# EAGLE design Spar7_rebuild (EAGLE 9.6.2)

## Sheet 1 of 3: Power rails
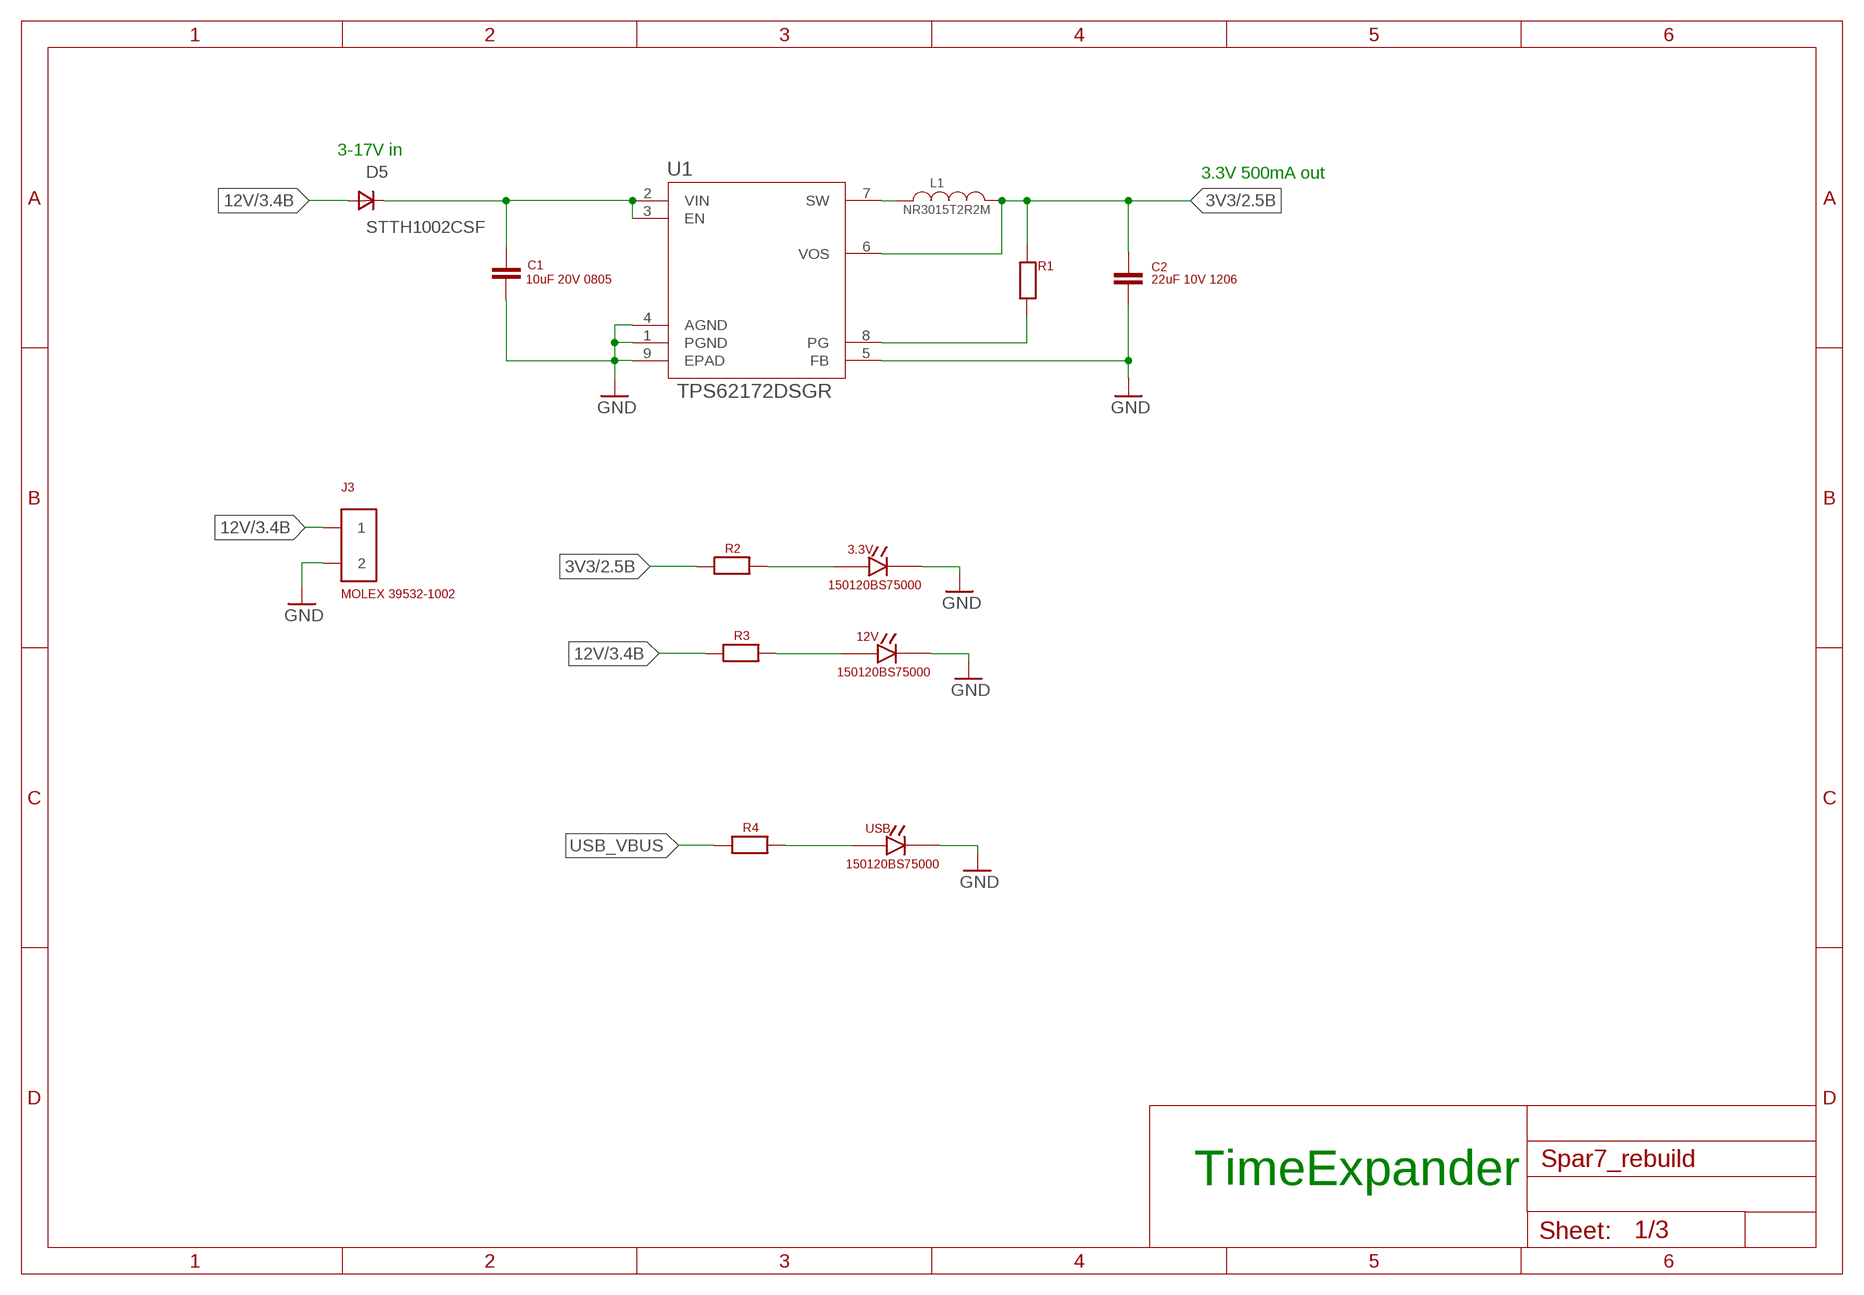
[diagram p0: schematic, sheet 1]

### Parts
3.3V  150120BS75000  LED150120BS75000  [150120BS75000]
12V  150120BS75000  LED150120BS75000  [150120BS75000]
C1  10uF 20V 0805  CAPACITOR0805  [CAP_0805]
C2  22uF 10V 1206  CAPACITOR1206  [CAP_1206]
D5  STTH1002CSF  DIODESTTH1002CSF  [DIODE_STTH1002CSF]
J3  MOLEX-39532-1002  [MOLEX-39532-1002]
L1  NR3015T2R2M  [IND_TAIYO_NR3015_TAY]
R1  RESISTOR0402  [RES_0402]
R2  RESISTOR0402  [RES_0402]
R3  RESISTOR0402  [RES_0402]
R4  RESISTOR0402  [RES_0402]
U1  TPS62172DSGR  TPS62173DSGR  [DSG8_1P6X0P9]
USB  150120BS75000  LED150120BS75000  [150120BS75000]

### Nets
3V3: C2.P$1 L1.1 R1.P$1 R2.P$1 U1.6(VOS) ; also sheet 2
12V: D5.A1(A) D5.A2(A) J3.1 R3.P$1 ; also sheet 3
GND: 3.3V.C 12V.C C1.P$2 C2.P$2 J3.2 U1.1(PGND) U1.4(AGND) U1.5(FB) U1.9(EPAD) USB.C ; also sheet 2,3
N$1: L1.2 U1.7(SW)
N$2: 12V.A R3.P$2
N$3: R1.P$2 U1.8(PG)
N$5: R4.P$2 USB.A
N$6: 3.3V.A R2.P$2
N$30: C1.P$1 D5.C U1.2(VIN) U1.3(EN)
USB_VBUS: R4.P$1 ; also sheet 2

### Notes on the sheet
- 3-17V in
- 3.3V 500mA out
- TimeExpander

## Sheet 2 of 3: MCU + USB
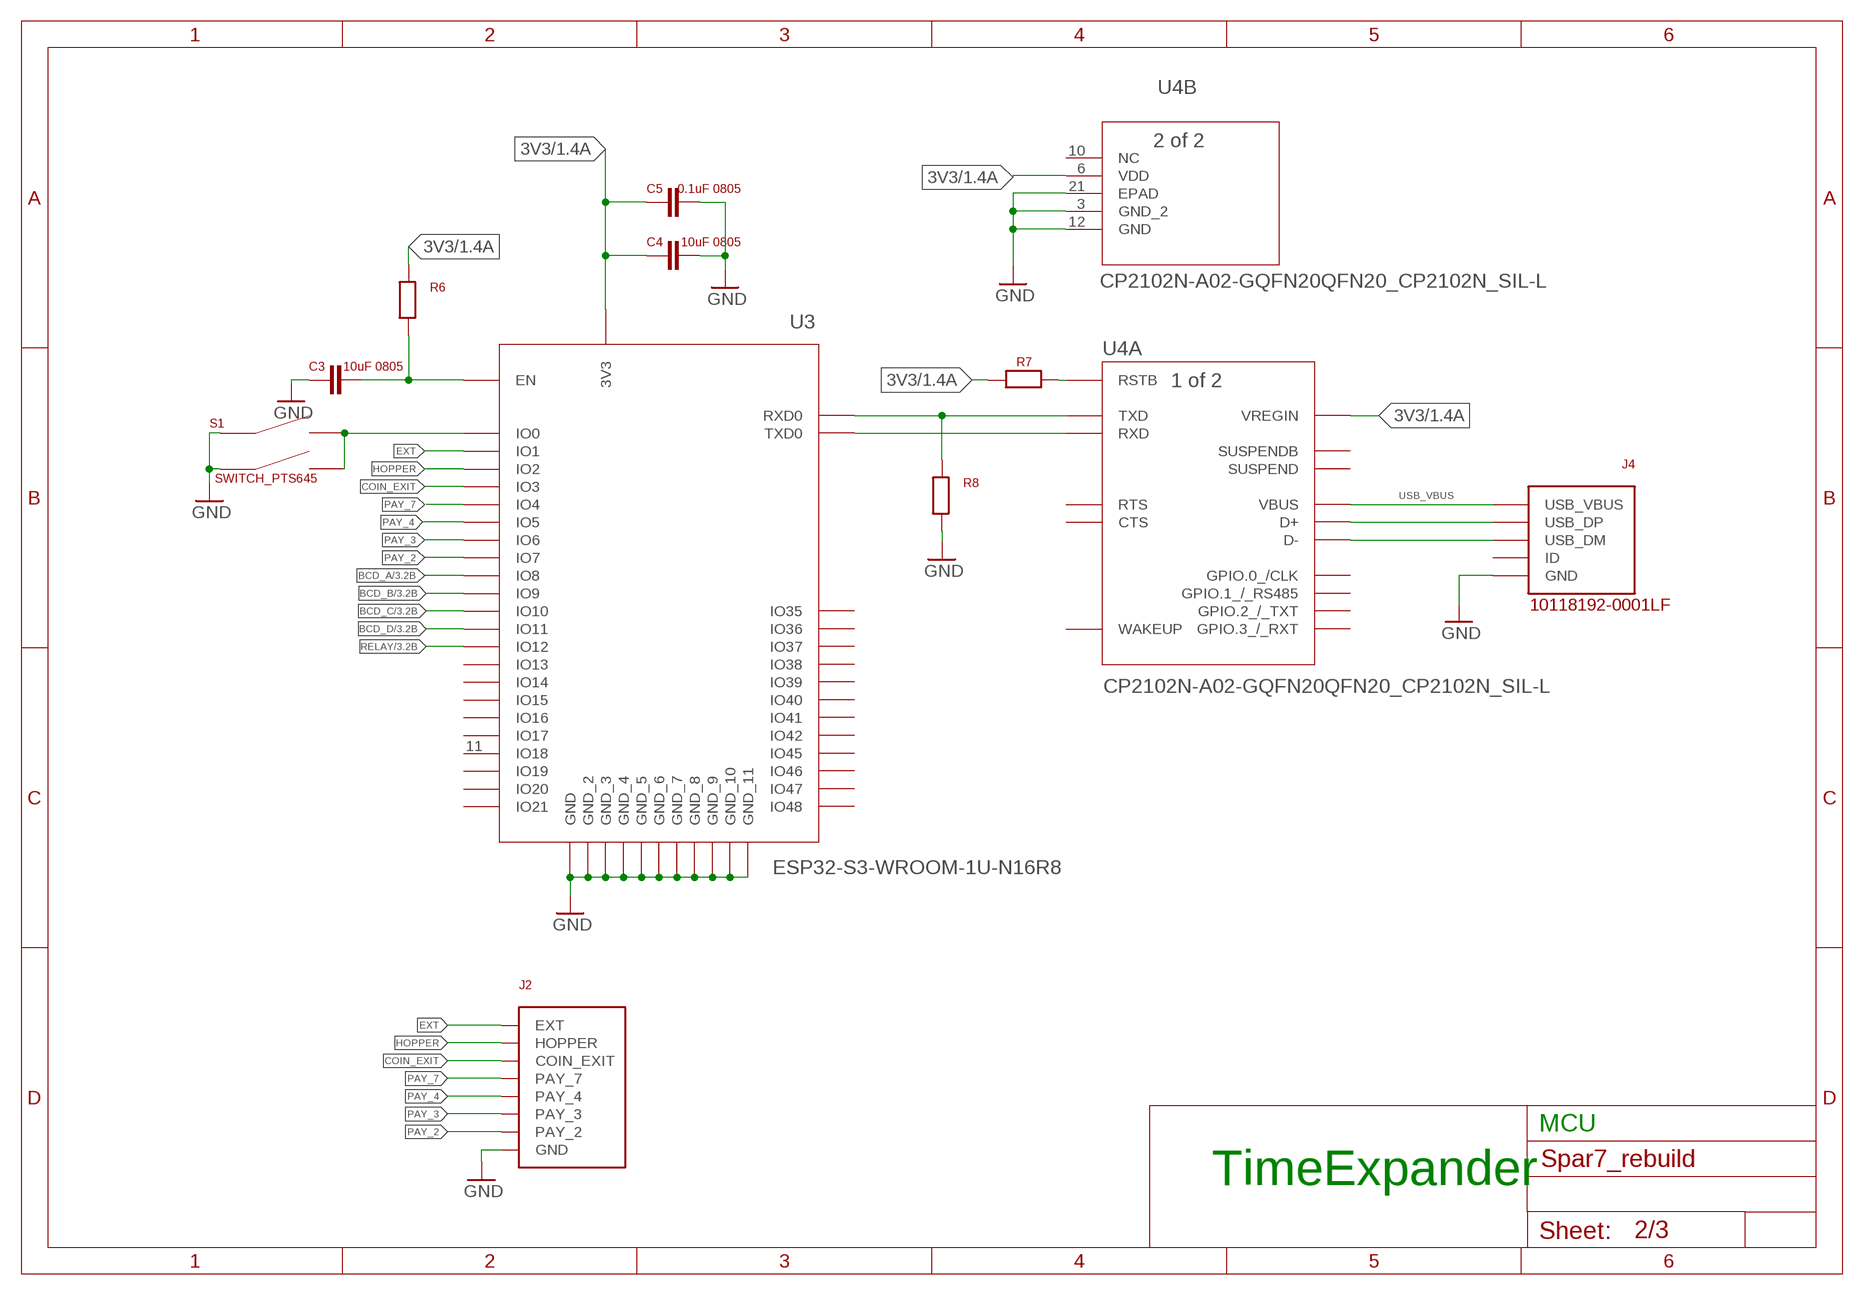
[diagram p1: schematic, sheet 2]

### Parts
C3  10uF 0805  CAPACITOR0805  [CAP_0805]
C4  10uF 0805  CAPACITOR0805  [CAP_0805]
C5  0.1uF 0805  CAPACITOR0805  [CAP_0805]
J2  SPAR7_REWIRED_TERM_BLOCK  [SPAR7_REWIRED_TERM_BLOCK]
J4  10118192-0001LF  USB_RCPT_10118192-0001LF  [USB_RCPT_10118192-0001LF]
R6  RESISTOR0402  [RES_0402]
R7  RESISTOR0402  [RES_0402]
R8  RESISTOR0402  [RES_0402]
S1  SWITCH_PTS645  [SWITCH_PTS645_EE_NBIOT_01]
U3  ESP32-S3-WROOM-1U-N16R8  [ESP32­S3­WROOM­1U_EXP]
U4  CP2102N-A02-GQFN20QFN20_CP2102N_SIL-L  [QFN20_CP2102N_SIL-L]

### Nets
3V3: C4.P$1 C5.P$1 R6.P$2 R7.P$1 U3.2(3V3) U4.6(B:VDD) U4.7(A:VREGIN) ; also sheet 1
BCD_A: U3.12(IO8) ; also sheet 3
BCD_B: U3.17(IO9) ; also sheet 3
BCD_C: U3.18(IO10) ; also sheet 3
BCD_D: U3.19(IO11) ; also sheet 3
COIN_EXIT: J2.COIN_EXIT U3.15(IO3)
EXT: J2.EXT U3.39(IO1)
GND: C3.P$1 C4.P$2 C5.P$2 J2.GND J4.GND R8.P$1 S1.A1 S1.A2 U3.1(GND_2) U3.40(GND_3) U3.41(GND_4) U3.42(GND_5) U3.43(GND_6) U3.44(GND_7) U3.45(GND_8) U3.46(GND_9) U3.47(GND_10) U3.48(GND_11) U3.49(GND) U4.3(B:GND_2) U4.12(B:GND) U4.21(B:EPAD) ; also sheet 1,3
HOPPER: J2.HOPPER U3.38(IO2)
N$31: J4.D+(USB_DP) U4.4(A:D+)
N$32: J4.D-(USB_DM) U4.5(A:D-)
N$33: R7.P$2 U4.9(A:RSTB)
N$34: R8.P$2 U3.36(RXD0) U4.18(A:TXD)
N$35: U3.37(TXD0) U4.17(A:RXD)
N$36: S1.B1 S1.B2 U3.27(IO0)
N$37: C3.P$2 R6.P$1 U3.3(EN)
PAY_2: J2.PAY_2 U3.7(IO7)
PAY_3: J2.PAY_3 U3.6(IO6)
PAY_4: J2.PAY_4 U3.5(IO5)
PAY_7: J2.PAY_7 U3.4(IO4)
RELAY: U3.20(IO12) ; also sheet 3
USB_VBUS: J4.VCC(USB_VBUS) U4.8(A:VBUS) ; also sheet 1
Unconnected: J4.ID U3.8(IO15) U3.9(IO16) U3.10(IO17) U3.11(IO18) U3.13(IO19) U3.14(IO20) U3.16(IO46) U3.21(IO13) U3.22(IO14) U3.23(IO21) U3.24(IO47) U3.25(IO48) U3.26(IO45) U3.28(IO35) U3.29(IO36) U3.30(IO37) U3.31(IO38) U3.32(IO39) U3.33(IO40) U3.34(IO41) U3.35(IO42) U4.1(A:GPIO.1_/_RS485) U4.2(A:GPIO.0_/CLK) U4.10(B:NC) U4.11(A:SUSPENDB) U4.13(A:WAKEUP) U4.14(A:SUSPEND) U4.15(A:CTS) U4.16(A:RTS) U4.19(A:GPIO.3_/_RXT) U4.20(A:GPIO.2_/_TXT)

### Notes on the sheet
- MCU
- TimeExpander

## Sheet 3 of 3: LED + RELAY
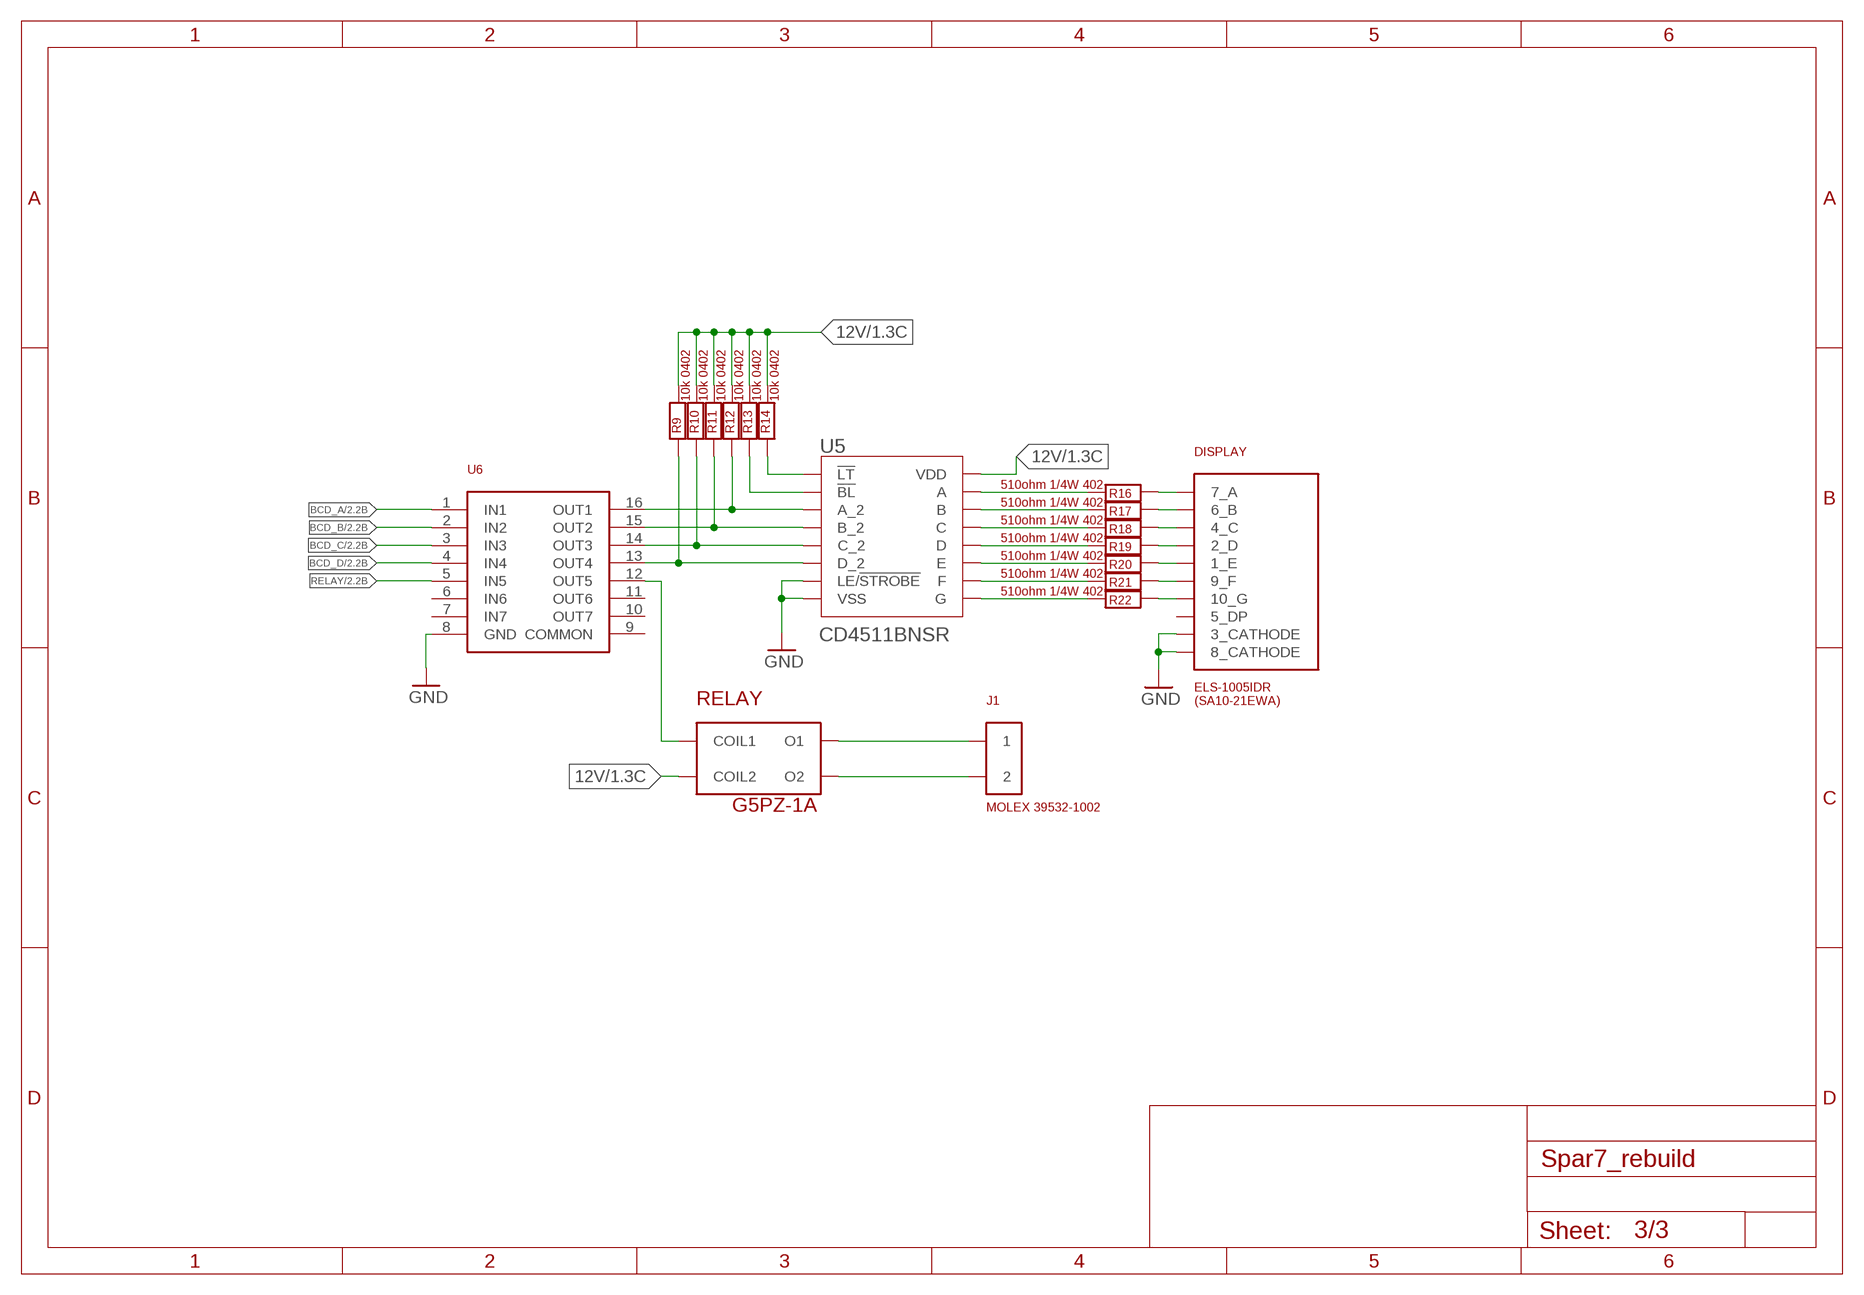
[diagram p2: schematic, sheet 3]

### Parts
DISPLAY  ELS-1005IDR-SA10-21EWA  [ELS-1005IDR-SA10-21EWA]
J1  MOLEX-39532-1002  [MOLEX-39532-1002]
R9  10k 0402  RESISTOR0402  [RES_0402]
R10  10k 0402  RESISTOR0402  [RES_0402]
R11  10k 0402  RESISTOR0402  [RES_0402]
R12  10k 0402  RESISTOR0402  [RES_0402]
R13  10k 0402  RESISTOR0402  [RES_0402]
R14  10k 0402  RESISTOR0402  [RES_0402]
R16  510ohm 1/4W 402  RESISTOR0402  [RES_0402]
R17  510ohm 1/4W 402  RESISTOR0402  [RES_0402]
R18  510ohm 1/4W 402  RESISTOR0402  [RES_0402]
R19  510ohm 1/4W 402  RESISTOR0402  [RES_0402]
R20  510ohm 1/4W 402  RESISTOR0402  [RES_0402]
R21  510ohm 1/4W 402  RESISTOR0402  [RES_0402]
R22  510ohm 1/4W 402  RESISTOR0402  [RES_0402]
RELAY  G5PZ-1A_RELAY  [G5PZ-1A_RELAY]
U5  CD4511BNSR  [NS16]
U6  ULN2003D1013TR  [SO16-NARROW]

### Nets
12V: R9.P$2 R10.P$2 R11.P$2 R12.P$2 R13.P$2 R14.P$2 RELAY.COIL2 U5.16(VDD) ; also sheet 1
BCD_A: U6.1(IN1) ; also sheet 2
BCD_B: U6.2(IN2) ; also sheet 2
BCD_C: U6.3(IN3) ; also sheet 2
BCD_D: U6.4(IN4) ; also sheet 2
GND: DISPLAY.3_CATHODE DISPLAY.8_CATHODE U5.5(LE/!STROBE) U5.8(VSS) U6.8(GND) ; also sheet 1,2
N$4: J1.1 RELAY.O1
N$7: DISPLAY.7_A R16.P$1
N$8: DISPLAY.6_B R17.P$1
N$9: DISPLAY.4_C R18.P$1
N$10: DISPLAY.2_D R19.P$1
N$11: DISPLAY.1_E R20.P$1
N$12: DISPLAY.9_F R21.P$1
N$13: DISPLAY.10_G R22.P$1
N$14: R16.P$2 U5.13(A)
N$15: R17.P$2 U5.12(B)
N$16: R18.P$2 U5.11(C)
N$17: R19.P$2 U5.10(D)
N$18: R20.P$2 U5.9(E)
N$19: R21.P$2 U5.15(F)
N$20: R22.P$2 U5.14(G)
N$21: R14.P$1 U5.3(!LT)
N$22: R13.P$1 U5.4(!BL)
N$23: R12.P$1 U5.7(A_2) U6.16(OUT1)
N$24: R11.P$1 U5.1(B_2) U6.15(OUT2)
N$25: R10.P$1 U5.2(C_2) U6.14(OUT3)
N$26: R9.P$1 U5.6(D_2) U6.13(OUT4)
N$27: RELAY.COIL1 U6.12(OUT5)
N$28: J1.2 RELAY.O2
RELAY: U6.5(IN5) ; also sheet 2
Unconnected: DISPLAY.5_DP U6.6(IN6) U6.7(IN7) U6.9(COMMON) U6.10(OUT7) U6.11(OUT6)

## Library data of the parts
3.3V 12V USB = TimeExpander2:LED
C1-C5 = TimeExpander2:CAPACITOR
D5 = TimeExpander2:DIODE
DISPLAY = TimeExpander2:ELS-1005IDR-SA10-21EWA
J1 J3 = TimeExpander2:MOLEX-39532-1002
J2 = TimeExpander2:SPAR7_REWIRED_TERM_BLOCK
J4 = TimeExpander2:USB_RCPT_10118192-0001LF
L1 = TimeExpander2:NR3015T2R2M; BUILT_BY: EMA_UL_Team; MANUFACTURER_PART_NUMBER: NR3015T2R2M; SOURCELIBRARY: TaiyoYuden_2011-01-01_IND_NR; VENDOR: TAIYO YUDEN
R1-R4 R6-R14 R16-R22 = TimeExpander2:RESISTOR
RELAY = TimeExpander2:G5PZ-1A_RELAY
S1 = TimeExpander2:SWITCH_PTS645
U1 = TimeExpander2:TPS62173DSGR; DATASHEET_URL: http://www.ti.com/lit/gpn/TPS62173; DESCRIPTION: 317V 0.5A Step-Down Converter in 2x2 QFN package; FAMILY_NAME: STEP-DOWN REGULATOR; GENERIC_PART_NUMBER: TPS62173; INDUSTRY_STD_PKG_TYPE: WSON; MANUFACTURER: Texas Instruments; MANUFACTURER_PART_NUMBER: TPS62173DSGR; PACKAGE_DESIGNATOR: DSG; PIN_COUNT: 8; VENDOR: Texas Instruments
U3 = TimeExpander2:ESP32-S3-WROOM-1U-N16R8; COPYRIGHT: Copyright (C) 2023 Ultra Librarian. All rights reserved.; MANUFACTURER_PART_NUMBER: ESP32-S3-WROOM-1U-N16R8; MFR_NAME: Espressif Systems
U4 = TimeExpander2:CP2102N-A02-GQFN20; COPYRIGHT: Copyright (C) 2023 Ultra Librarian. All rights reserved.; MANUFACTURER_PART_NUMBER: CP2102N-A02-GQFN20; MFR_NAME: Silicon Labs
U5 = TimeExpander2:CD4511BNSR; COPYRIGHT: Copyright (C) 2023 Ultra Librarian. All rights reserved.; MANUFACTURER_PART_NUMBER: CD4511BNSR; MFR_NAME: Texas Instruments
U6 = EE_copy:ULN2003D1013TR

## Board
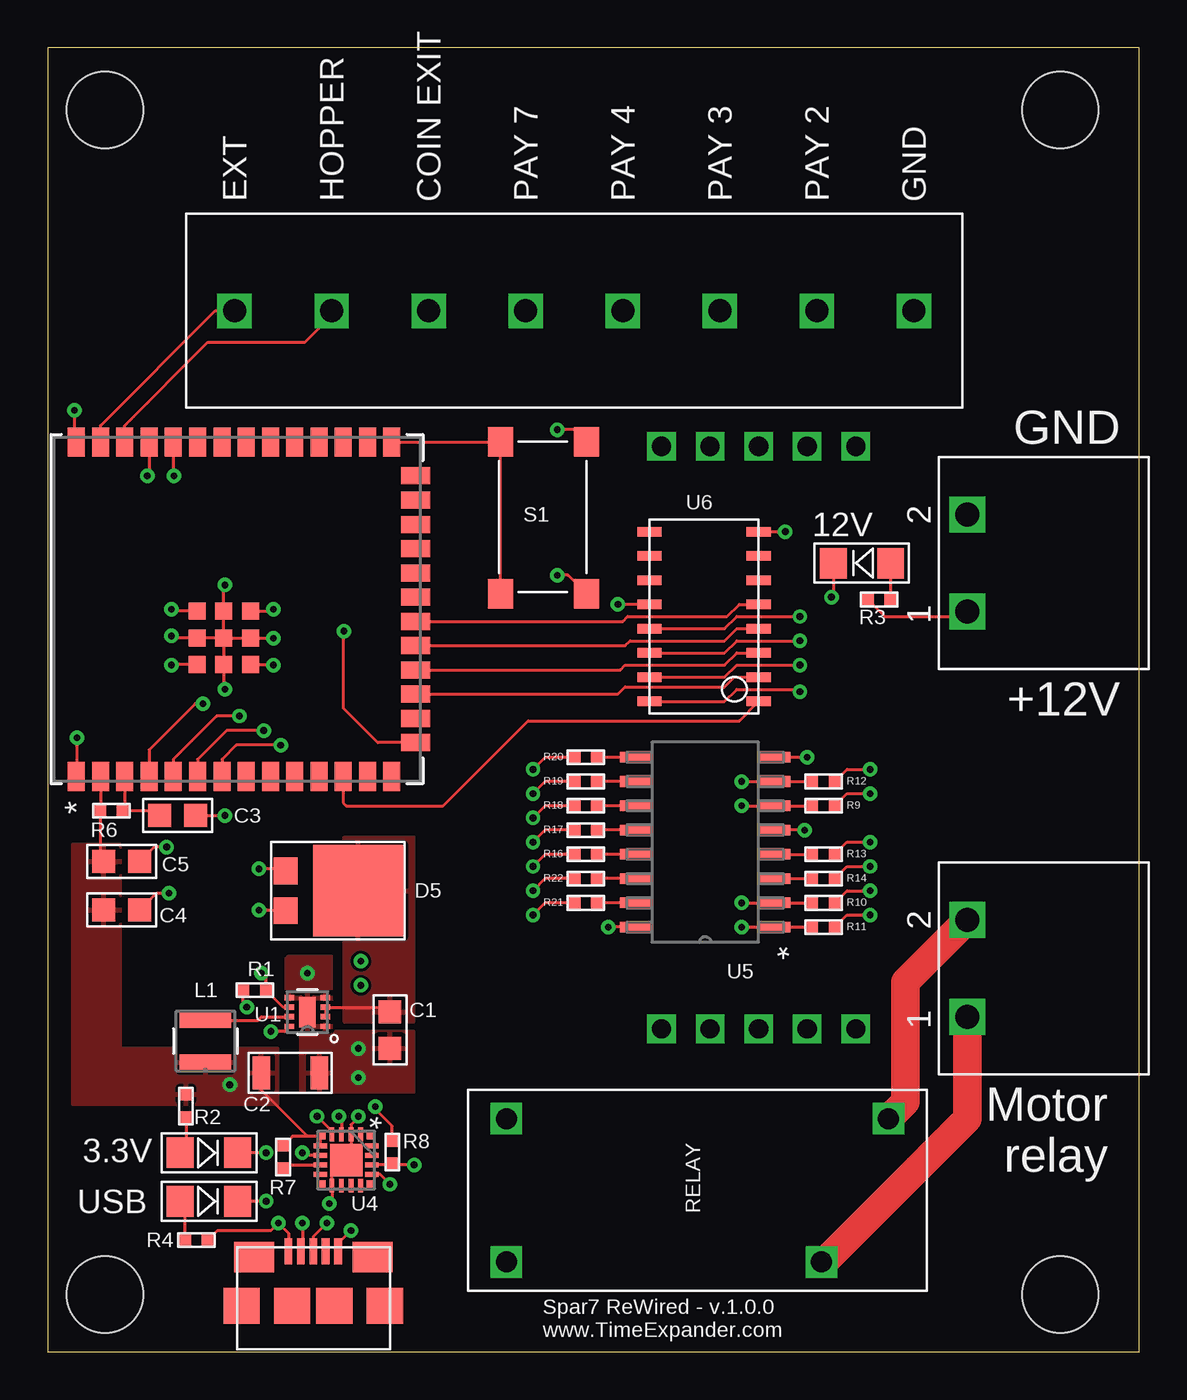
[diagram p3: board, top side]
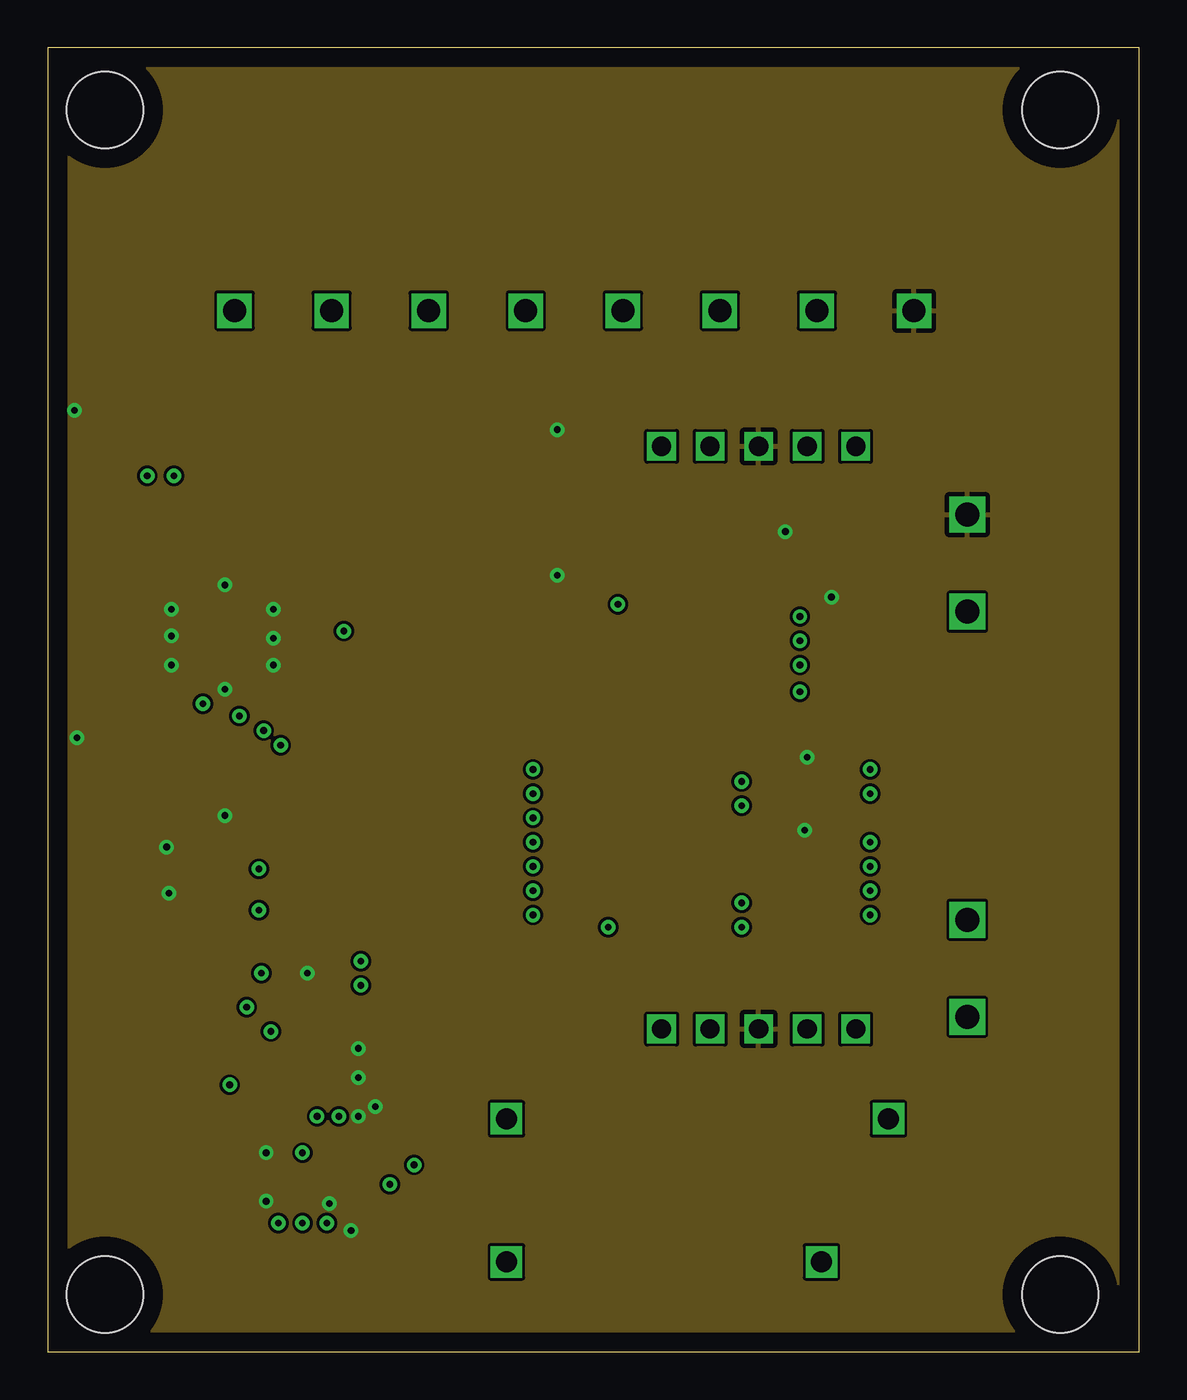
[diagram p4: board, inner layer GND]
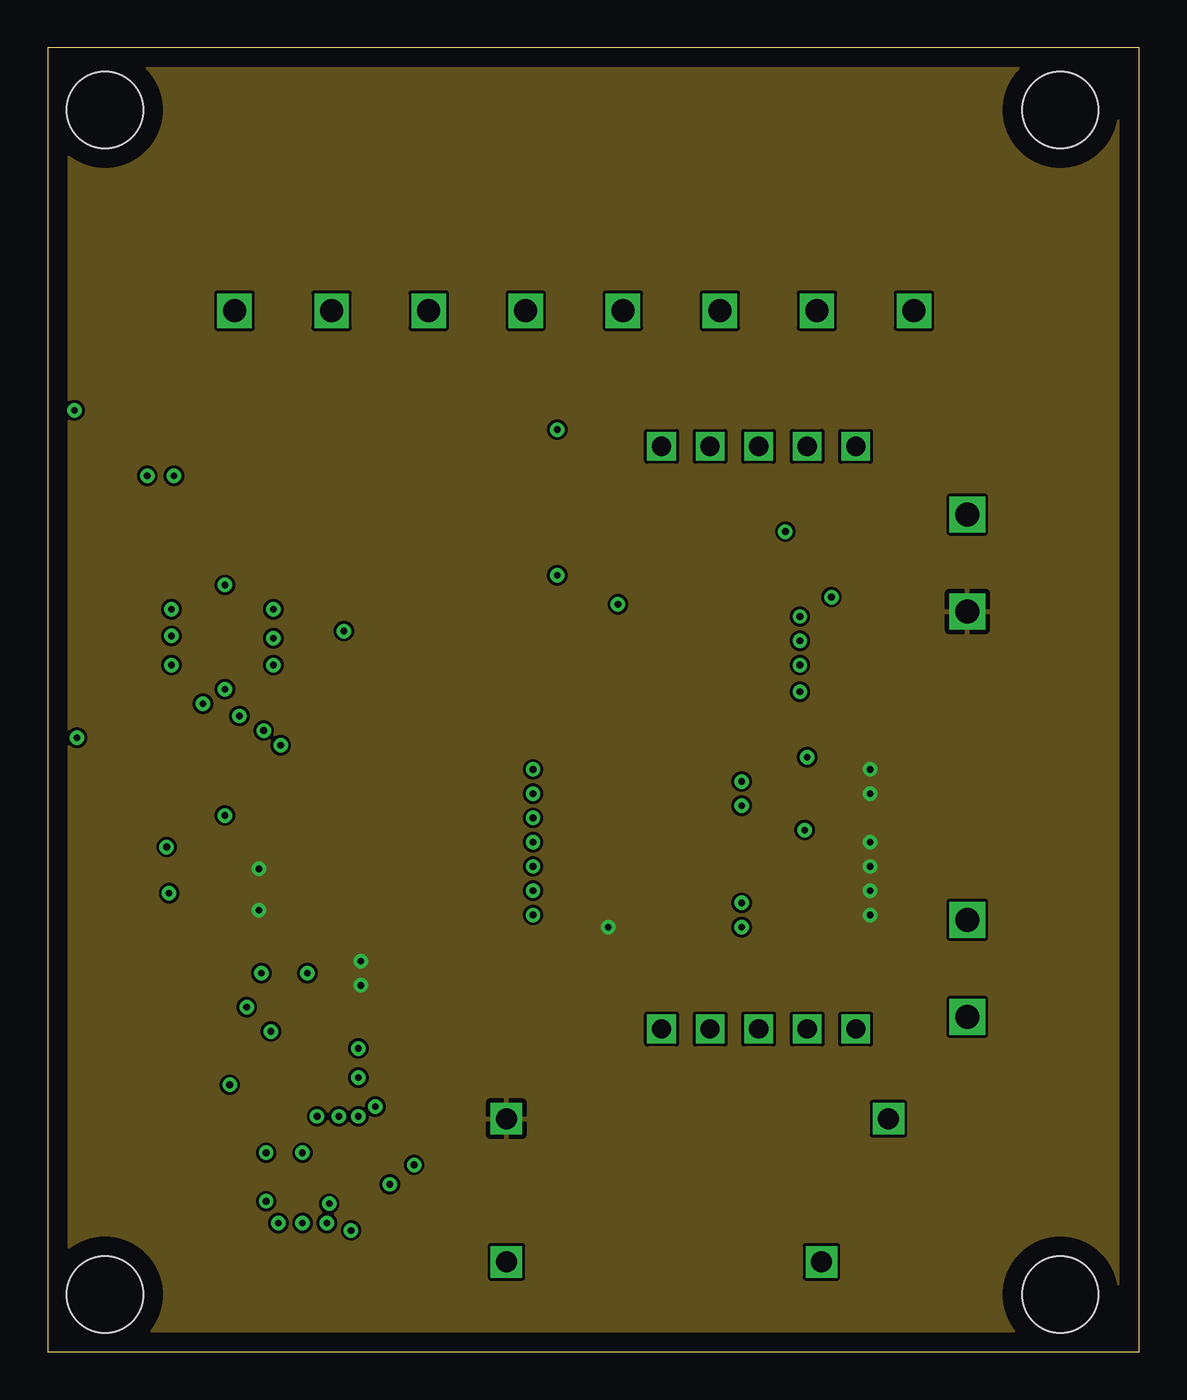
[diagram p5: board, inner layer 12V]
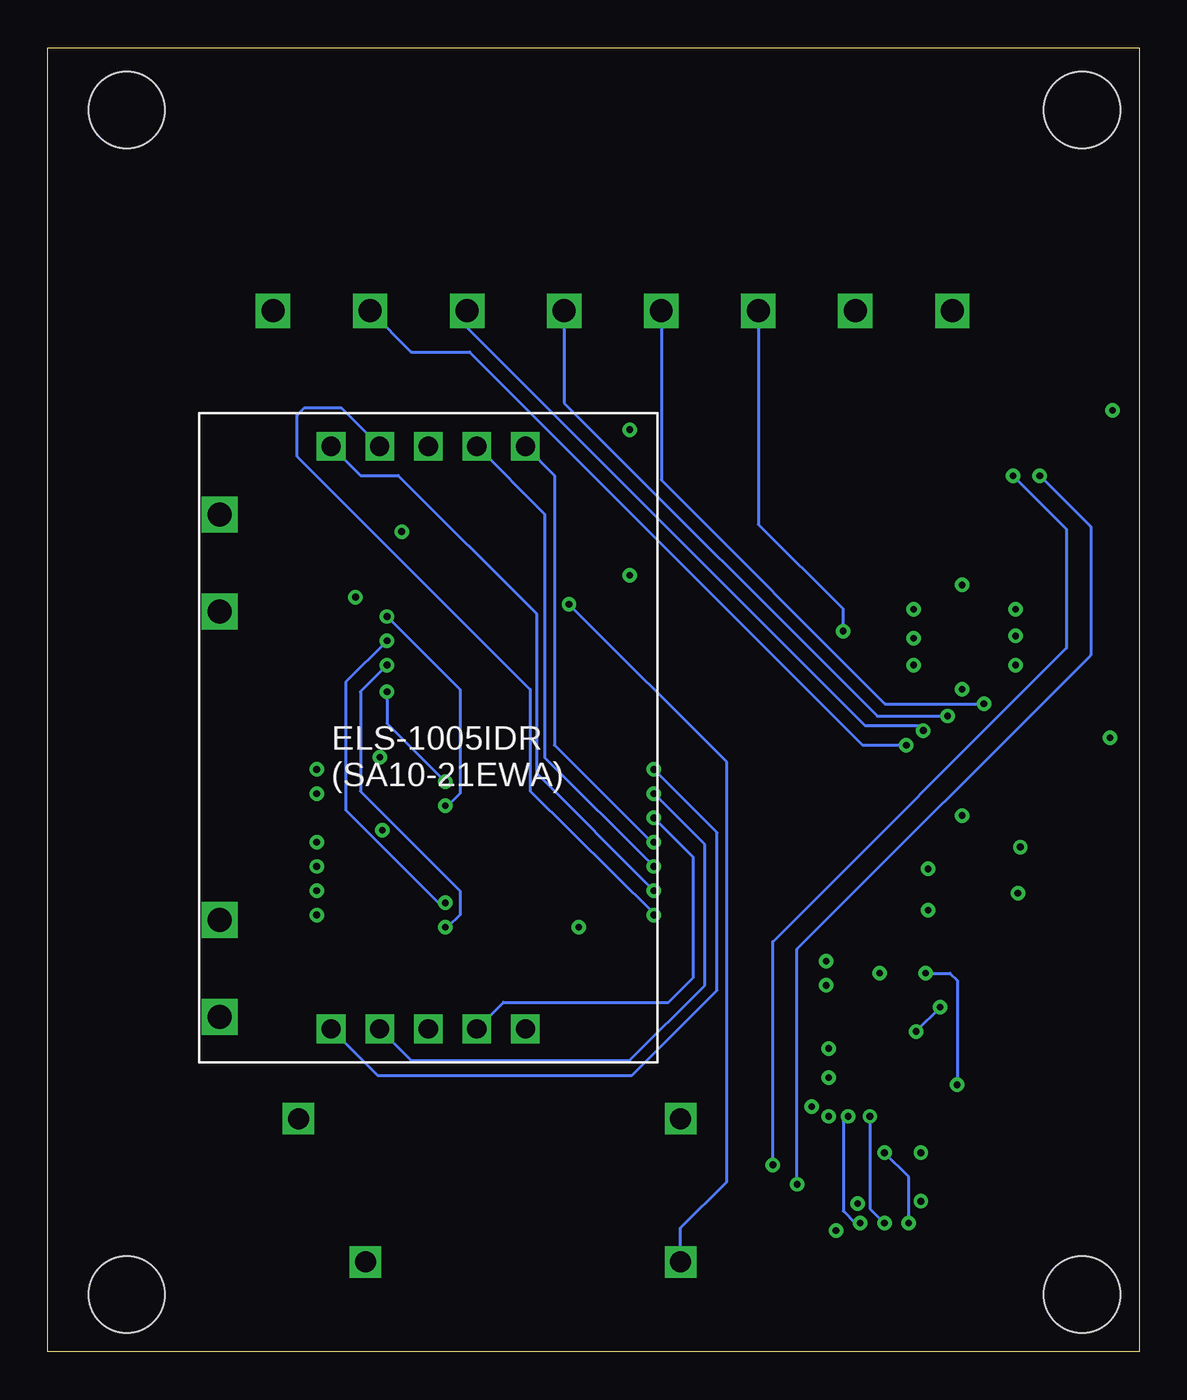
[diagram p6: board, bottom side, seen from below]

Size 57.13 x 68.25 mm. Coordinates in mm from the lower left corner, seen from the top.
Outline: 0,0 57.13,0 57.13,68.25 0,68.25 0,0
Copper layers (1+2*15+16): Top 0.035mm / dielectric 1.5mm / GND 0.035mm / dielectric 0.15mm / 12V 0.035mm / dielectric 0.2mm / Bottom 0.035mm
Design rules "default *": minimum track width 6mil, minimum drill 0.35mm, track to track 6mil, track to pad 6mil, pad to pad 6mil, via to via 6mil, smd to smd 6mil, copper to edge 40mil, drill to drill 6mil, minimum pad ring 10mil, minimum via ring 8mil, stop-mask expansion 6mil, vias tented up to drill 14mil, thermal gap 10mil
Holes 4 mm at 3,65 53,65 3,3 53,3

### Footprints (pad centres in the part's own frame; a part is rotated, then mirrored left to right if it is on the bottom)
150120BS75000 = smd 1.4 x 1.6: A -3,0; C -6,0
CAP_0805 = smd 1.2 x 1.2: P$1 0,0; P$2 1.9,0
CAP_1206 = smd 0.914 x 1.72: P$1 0,0; P$2 3.048,0
DIODE_STTH1002CSF = smd 1.4 x 1.27: A1 -1.04,-3.805; A2 1.04,-3.805 | smd 4.8 x 4.72: C 0,0
ELS-1005IDR-SA10-21EWA = drill 1 square: 1_E 0,0; 2_D 2.54,0; 3_CATHODE 5.08,0; 4_C 7.62,0; 5_DP 10.16,0; 6_B 10.16,30.5; 7_A 7.62,30.5; 8_CATHODE 5.08,30.5; 9_F 2.54,30.5; 10_G 0,30.5
MOLEX-39532-1002 = drill 1.25 square: 1 5.08,0; 2 0,0
SPAR7_REWIRED_TERM_BLOCK = drill 1.2 square: COIN_EXIT 10.16,0; EXT 0,0; GND 35.56,0; HOPPER 5.08,0; PAY_2 30.48,0; PAY_3 25.4,0; PAY_4 20.32,0; PAY_7 15.24,0
USB_RCPT_10118192-0001LF = smd 0.4 x 1.35: D+ 3.1,0.3; D- 2.45,0.3; GND 4.4,0.3; ID 3.75,0.3; VCC 1.8,0.3 | smd 2.1 x 1.6: P$1 0,0; P$2 6.2,0 | smd 1.9 x 1.9: P$8 -0.65,-2.55; P$9 6.85,-2.55; P$10 2,-2.55; P$11 4.2,-2.55
IND_TAIYO_NR3015_TAY = smd 0.8 x 2.692: 1 -1.099,0; 2 1.099,0
RES_0402 = smd 0.635 x 0.61: P$1 0,0; P$2 1.194,0
G5PZ-1A_RELAY = drill 1.1 square: COIL1 0,0; COIL2 0,7.5; O1 16.5,0; O2 20,7.5
SWITCH_PTS645_EE_NBIOT_01 = smd 1.55 x 1.3: A1 0,0; A2 7.95,0; B1 0,-4.5; B2 7.95,-4.5
DSG8_1P6X0P9 = smd 0.5 x 0.28: 1 -0.95,0.75; 2 -0.95,0.25; 3 -0.95,-0.25; 4 -0.95,-0.75; 5 0.95,-0.75; 6 0.95,-0.25; 7 0.95,0.25; 8 0.95,0.75 | smd 0.889 x 1.6: 9 0,0
ESP32­S3­WROOM­1U_EXP = smd 1.499 x 0.889: 1 -8.75,8.41; 2 -8.75,7.14; 3 -8.75,5.87; 4 -8.75,4.6; 5 -8.75,3.33; 6 -8.75,2.06; 7 -8.75,0.79; 8 -8.75,-0.48; 9 -8.75,-1.75; 10 -8.75,-3.02; 11 -8.75,-4.29; 12 -8.75,-5.56; 13 -8.75,-6.83; 14 -8.75,-8.1; 27 8.75,-8.1; 28 8.75,-6.83; 29 8.75,-5.56; 30 8.75,-4.29; 31 8.75,-3.02; 32 8.75,-1.75; 33 8.75,-0.48; 34 8.75,0.79; 35 8.75,2.06; 36 8.75,3.33; 37 8.75,4.6; 38 8.75,5.87; 39 8.75,7.14; 40 8.75,8.41 | smd 0.889 x 1.499: 15 -6.985,-9.35; 16 -5.715,-9.35; 17 -4.445,-9.35; 18 -3.175,-9.35; 19 -1.905,-9.35; 20 -0.635,-9.35; 21 0.635,-9.35; 22 1.905,-9.35; 23 3.175,-9.35; 24 4.445,-9.35; 25 5.715,-9.35; 26 6.985,-9.35 | smd 0.889 x 0.889: 41 -1.501,0.691; 42 -1.501,2.09; 43 -2.901,2.09; 44 -2.901,0.691; 45 -2.901,-0.709; 46 -1.501,-0.709; 47 -0.102,-0.709; 48 -0.102,0.691; 49 -0.102,2.09
QFN20_CP2102N_SIL-L = smd 0.356 x 0.356: 1 -1.25,1.25; 6 -1.25,-1.25; 11 1.25,-1.25; 16 1.25,1.25 | smd 0.708 x 0.255: 2 -1.345,0.75; 3 -1.345,0.25; 4 -1.345,-0.25; 5 -1.345,-0.75; 12 1.345,-0.75; 13 1.345,-0.25; 14 1.345,0.25; 15 1.345,0.75 | smd 0.255 x 0.708: 7 -0.75,-1.345; 8 -0.25,-1.345; 9 0.25,-1.345; 10 0.75,-1.345; 17 0.75,1.345; 18 0.25,1.345; 19 -0.25,1.345; 20 -0.75,1.345 | smd 1.702 x 1.702: 21 0,0
NS16 = smd 1.741 x 0.558: 1 -3.581,4.445; 2 -3.581,3.175; 3 -3.581,1.905; 4 -3.581,0.635; 5 -3.581,-0.635; 6 -3.581,-1.905; 7 -3.581,-3.175; 8 -3.581,-4.445; 9 3.581,-4.445; 10 3.581,-3.175; 11 3.581,-1.905; 12 3.581,-0.635; 13 3.581,0.635; 14 3.581,1.905; 15 3.581,3.175; 16 3.581,4.445
SO16-NARROW = smd 1.27 x 0.5: 1 0,8.89; 2 0,7.62; 3 0,6.35; 4 0,5.08; 5 0,3.81; 6 0,2.54; 7 0,1.27; 8 0,0; 9 5.715,0; 10 5.715,1.27; 11 5.715,2.54; 12 5.715,3.81; 13 5.715,5.08; 14 5.715,6.35; 15 5.715,7.62; 16 5.715,8.89

### Placement (x,y rotation side)
3.3V  3.94,10.41 180 top
12V  47.12,41.27 0 top
C1  17.91,17.78 270 top
C2  11.18,14.61 0 top
C3  7.75,28.07 180 top
C4  2.92,23.11 0 top
C5  2.92,25.65 0 top
D5  16.26,24.13 270 top
DISPLAY  42.29,16.89 0 bottom
J1  48.13,22.61 270 top
J2  9.78,54.48 0 top
J3  48.13,43.81 270 top
J4  10.79,4.95 0 top
L1  8.26,16.26 90 top
R1  11.43,18.92 180 top
R2  7.24,13.46 270 top
R3  42.93,39.37 0 top
R4  8.38,5.84 180 top
R6  3.94,28.32 180 top
R7  12.32,10.79 270 top
R8  18.03,11.05 270 top
R9  40.01,28.57 0 top
R10  40.01,23.5 0 top
R11  40.01,22.23 0 top
R12  40.01,29.84 0 top
R13  40.01,26.04 0 top
R14  40.01,24.77 0 top
R16  27.56,26.04 0 top
R17  27.56,27.3 0 top
R18  27.56,28.57 0 top
R19  27.56,29.84 0 top
R20  27.56,31.11 0 top
R21  27.56,23.5 0 top
R22  27.56,24.77 0 top
RELAY  24,4.7 0 top
S1  28.19,47.62 270 top
U1  13.59,17.78 180 top
U3  9.91,38.86 90 top
U4  15.62,10.03 270 top
U5  34.42,26.67 180 top
U6  37.21,42.93 180 top
USB  3.94,7.87 180 top

### Tracks (layer width: path | path; a pad name or v marks a point on that pad's centre or on a via)
3V3  (via drill 0.35)
  Top 0.152: U3.2 2.77,28.34 R6.P$2 2.74,25.83 C5.P$1 | U4.6 13.61,11.28 11.18,13.72 C2.P$1 | U4.6 12.81,11.28 R7.P$1 | U4.7 14.28,11.19 U4.6 | U1.6 12.32,18.03 R1.P$1 11.43,19.56 v11.18,19.81
  Bottom 0.152: v11.18,19.81 9.91,19.81 9.53,19.43 v9.53,13.97
  pour Top: 1.27,26.54 1.27,12.95 12.06,12.95 12.06,15.88 3.81,15.88 3.81,26.54
12V  (via drill 0.35)
  Top 0.152: U5.16 v29.34,22.23 | R12.P$2 41.83,30.48 v43.05,30.48 | R9.P$2 41.83,29.21 v43.05,29.21 | R13.P$2 41.83,26.67 v43.05,26.67 | R14.P$2 41.83,25.4 v43.05,25.4 | R10.P$2 41.83,24.13 v43.05,24.13 | R11.P$2 41.83,22.86 v43.05,22.86 | R3.P$1 43.81,38.48 47.88,38.48 J3.1 | D5.A1 12.35,25.27 v11.05,25.27 | D5.A2 11.07,23.09 v11.05,23.11
  other vias: 16.38,19.18 16.38,20.45
  pour 12V: 0,0 0,68.45 57.15,68.45 57.15,0
BCD_A
  Top 0.152: U3.12 15.47,28.73 15.62,28.57 20.7,28.57 25.15,33.02 36.2,33.02 U6.1
BCD_B
  Top 0.152: U3.17 29.84,34.42 30.23,34.8 35.43,34.8 35.94,35.31 U6.2
BCD_C
  Top 0.152: U3.18 29.97,35.69 30.23,35.94 35.43,35.94 36.07,36.58 U6.3
BCD_D
  Top 0.152: U3.19 30.23,36.96 30.48,37.21 35.43,37.21 36.07,37.85 U6.4
COIN_EXIT  (via drill 0.35)
  Top 0.152: U3.15 17.27,31.88 15.49,33.66 v15.49,37.72
  Bottom 0.152: J2.COIN_EXIT 19.94,43.31 15.49,38.86 v15.49,37.72
EXT
  Top 0.152: U3.39 2.77,48.49 8.76,54.48 J2.EXT
GND  (via drill 0.35)
  Top 0.152: v9.27,40.13 9.21,40.08 U3.48 U3.41 | U3.49 6.58,38.76 v6.48,38.86 | v6.48,37.47 6.58,37.36 U3.42 U3.41 | U3.47 11.71,38.76 v11.81,38.86 | v11.81,37.34 11.79,37.36 U3.46 U3.41 | U3.45 11.79,35.96 v11.81,35.94 | v9.27,34.67 9.21,34.73 U3.44 U3.41 | U3.43 6.5,35.96 v6.48,35.94 | v1.52,32.13 1.52,30.14 U3.1 | v1.4,49.28 1.4,47.71 U3.40 | v39.62,27.3 U5.5 | v39.75,31.11 U5.8 | v6.22,26.42 5.58,26.42 C5.P$2 | C3.P$1 v9.27,28.07 | 12V.C 41.12,39.59 v41.02,39.5 | U6.8 v38.61,42.93 | S1.A1 27.56,48.26 v26.67,48.26 | S1.A2 27.23,40.64 v26.67,40.64 | C4.P$2 5.71,24 v6.35,24 | v11.43,10.41 3.3V.C | v11.43,7.87 USB.C | R8.P$1 18.03,11.81 17.14,12.7 v17.14,12.83 | v16.26,12.32 16.26,12.27 15.87,11.89 U4.3 15.87,10.28 U4.21 14.87,9.28 U4.12 14.87,7.89 v14.73,7.75 | J4.GND 15.2,5.67 v15.88,6.35
  other vias: 16.26,15.88 16.26,14.35 13.59,19.81
  pour GND: 0,0 0,68.58 57.15,68.58 57.15,0
  pour Top: 19.18,13.59 19.18,16.76 14.86,16.76 14.86,17.14 13.97,17.14 13.97,18.41 14.86,18.41 14.86,20.7 12.57,20.7 12.45,20.57 12.45,18.41 12.57,18.29 13.21,18.29 13.21,13.59
HOPPER
  Top 0.152: U3.38 4.04,48.49 8.38,52.83 13.46,52.83 14.86,54.23 J2.HOPPER
N$1
  Top 0.152: L1.2 11.01,17.36 11.18,17.53 U1.7
N$2
  Top 0.152: 12V.A R3.P$2
N$3  (via drill 0.35)
  Top 0.152: U1.8 12.37,16.76 v11.68,16.76 | v10.41,18.03 10.24,18.21 R1.P$2
  Bottom 0.152: v10.41,18.03 v11.68,16.76
N$4
  Top 1.5: J1.1 48.13,12.19 40.64,4.7 RELAY.O1
N$5
  Top 0.152: R4.P$2 7.19,7.52 6.94,7.78 USB.A
N$6
  Top 0.152: R2.P$2 7.24,10.72 3.3V.A
N$7  (via drill 0.35)
  Top 0.152: R16.P$1 26.04,26.04 v25.4,25.4
  Bottom 0.152: v25.4,25.4 31.11,31.11 31.11,43.84 DISPLAY.7_A
N$8  (via drill 0.35)
  Top 0.152: R17.P$1 26.04,27.3 v25.4,26.67
  Bottom 0.152: v25.4,26.67 25.53,26.67 30.61,31.75 30.61,45.87 DISPLAY.6_B
N$9  (via drill 0.35)
  Top 0.152: R18.P$1 26.04,28.57 v25.4,27.94
  Bottom 0.152: DISPLAY.4_C 33.27,18.29 24.64,18.29 23.37,19.56 23.37,25.91 v25.4,27.94
N$10  (via drill 0.35)
  Top 0.152: R19.P$1 26.04,29.84 v25.4,29.21
  Bottom 0.152: DISPLAY.2_D 38.1,15.24 26.67,15.24 22.73,19.18 22.73,26.54 v25.4,29.21
N$11  (via drill 0.35)
  Top 0.152: R20.P$1 26.04,31.11 v25.4,30.48
  Bottom 0.152: DISPLAY.1_E 39.88,14.48 26.54,14.48 22.1,18.92 22.1,27.18 v25.4,30.48
N$12  (via drill 0.35)
  Top 0.152: R21.P$1 26.04,23.5 v25.4,22.86
  Bottom 0.152: v25.4,22.86 25.4,22.94 31.88,29.34 31.88,34.67 44.07,46.86 44.07,49.02 43.69,49.4 41.76,49.4 DISPLAY.9_F
N$13  (via drill 0.35)
  Top 0.152: R22.P$1 26.04,24.77 v25.4,24.13
  Bottom 0.152: v25.4,24.13 31.52,30.25 31.52,38.6 38.79,45.87 40.77,45.87 DISPLAY.10_G
N$14
  Top 0.152: U5.13 R16.P$2
N$15
  Top 0.152: U5.12 R17.P$2
N$16
  Top 0.152: U5.11 R18.P$2
N$17
  Top 0.152: U5.10 R19.P$2
N$18
  Top 0.152: U5.9 R20.P$2
N$19
  Top 0.152: U5.15 R21.P$2
N$20
  Top 0.152: U5.14 R22.P$2
N$21
  Top 0.152: U5.3 R14.P$1
N$22
  Top 0.152: U5.4 R13.P$1
N$23  (via drill 0.35)
  Top 0.152: R12.P$1 U5.7 v36.32,29.84 | U6.16 35.43,34.04 36.07,34.67 39.24,34.67 v39.37,34.54
  Bottom 0.152: v39.37,34.54 39.37,32.89 v36.32,29.84
N$24  (via drill 0.35)
  Top 0.152: R11.P$1 U5.1 v36.32,22.23 | U6.15 35.43,35.31 36.07,35.94 v39.37,35.94
  Bottom 0.152: v39.37,35.94 40.77,34.54 40.77,29.34 35.56,24.13 35.56,22.86 36.2,22.23 v36.32,22.23
N$25  (via drill 0.35)
  Top 0.152: R10.P$1 U5.2 v36.32,23.5 | U6.14 35.43,36.58 36.07,37.21 v39.37,37.21
  Bottom 0.152: v39.37,37.21 41.53,35.05 41.53,28.35 36.67,23.5 v36.32,23.5
N$26  (via drill 0.35)
  Top 0.152: R9.P$1 U5.6 v36.32,28.57 | v39.37,38.48 36.07,38.48 35.43,37.85 U6.13
  Bottom 0.152: v39.37,38.48 35.56,34.67 35.56,29.21 36.2,28.57 v36.32,28.57
N$27  (via drill 0.35)
  Top 0.152: U6.12 v29.84,39.12
  Bottom 0.152: RELAY.COIL1 24,6.48 21.59,8.89 21.59,30.86 v29.84,39.12
N$28
  Top 1.5: J1.2 44.89,19.36 44.89,13.09 RELAY.O2
N$30
  Top 0.152: C1.P$1 17.66,18.03 U1.3 U1.2
  pour Top: 19.18,17.27 19.18,26.92 15.49,26.92 15.49,17.27
N$31  (via drill 0.35)
  Top 0.152: v15.24,12.32 15.37,12.19 U4.4 | v14.61,6.73 13.89,6.02 J4.D+
  Bottom 0.152: v15.24,12.32 15.49,12.06 15.49,7.37 14.86,6.73 v14.61,6.73
N$32  (via drill 0.35)
  Top 0.152: v14.1,12.32 14.87,11.54 U4.5 | v13.34,6.73 13.34,5.34 J4.D-
  Bottom 0.152: v14.1,12.32 14.1,7.49 v13.34,6.73
N$33
  Top 0.152: R7.P$2 12.5,9.78 U4.9
N$34  (via drill 0.35)
  Top 0.152: U3.36 6.58,45.88 v6.6,45.85 | U4.18 17.96,9.78 R8.P$2 18.11,9.78 v19.18,9.78
  Bottom 0.152: v6.6,45.85 3.81,43.05 3.81,36.83 19.18,21.46 v19.18,9.78
N$35  (via drill 0.35)
  Top 0.152: U3.37 5.31,45.95 v5.21,45.85 | U4.17 17.39,9.28 v17.91,8.76
  Bottom 0.152: v5.21,45.85 2.54,43.18 2.54,36.45 17.91,21.08 v17.91,8.76
N$36
  Top 0.152: U3.27 S1.B1 S1.B2
N$37
  Top 0.152: U3.3 4.04,28.42 R6.P$1 5.59,28.32 C3.P$2
PAY_2  (via drill 0.35)
  Top 0.152: v12.19,31.75 9.87,31.75 9.12,31 U3.7
  Bottom 0.152: J2.PAY_2 38.1,52.32 35.05,52.32 14.48,31.75 v12.19,31.75
PAY_3  (via drill 0.35)
  Top 0.152: v11.3,32.51 9.36,32.51 7.85,31 U3.6
  Bottom 0.152: J2.PAY_3 35.18,53.59 14.35,32.77 11.56,32.77 v11.3,32.51
PAY_4  (via drill 0.35)
  Top 0.152: v10.03,33.27 8.85,33.27 6.58,31 U3.5
  Bottom 0.152: J2.PAY_4 30.1,49.66 13.72,33.27 v10.03,33.27
PAY_7  (via drill 0.35)
  Top 0.152: v8.13,33.91 7.71,33.91 5.31,31.51 U3.4
  Bottom 0.152: J2.PAY_7 25.02,45.62 13.3,33.91 v8.13,33.91
RELAY
  Top 0.152: U3.20 30.1,38.23 30.35,38.48 35.56,38.48 36.2,39.12 U6.5
USB_VBUS  (via drill 0.35)
  Top 0.152: J4.VCC 12.6,6.2 v12.06,6.73 11.68,6.35 8.89,6.35 R4.P$1 | U4.8 13.47,10.28 v13.34,10.41
  Bottom 0.152: v12.06,6.73 12.06,9.14 v13.34,10.41

### Text on the board
tPlace: GND | +12V | Motor / relay | Spar7 ReWired - v.1.0.0 / www.TimeExpander.com